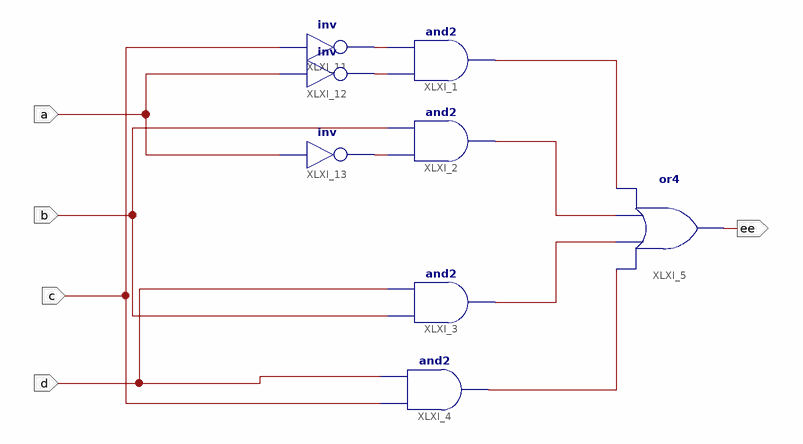
[diagram p0: schematic sheet 1]
// Xilinx ISE schematic hexE.sch (spartan6) as structural Verilog: 8 symbols, 5 ports
module hexE (
  input  a,
  input  b,
  input  c,
  input  d,
  output ee
);

  wire XLXN_1, XLXN_2, XLXN_3, XLXN_4, XLXN_5, XLXN_6, XLXN_7;

  and XLXI_1 (XLXN_1, XLXN_6, XLXN_5);
  and XLXI_2 (XLXN_2, XLXN_7, b);
  and XLXI_3 (XLXN_3, b, d);
  and XLXI_4 (XLXN_4, c, d);
  or XLXI_5 (ee, XLXN_4, XLXN_3, XLXN_2, XLXN_1);
  not XLXI_11 (XLXN_5, c);
  not XLXI_12 (XLXN_6, a);
  not XLXI_13 (XLXN_7, a);
endmodule
